# EAGLE schematic ww101board (EAGLE 7.6.0)

## Sheet 1 of 4: User Interface
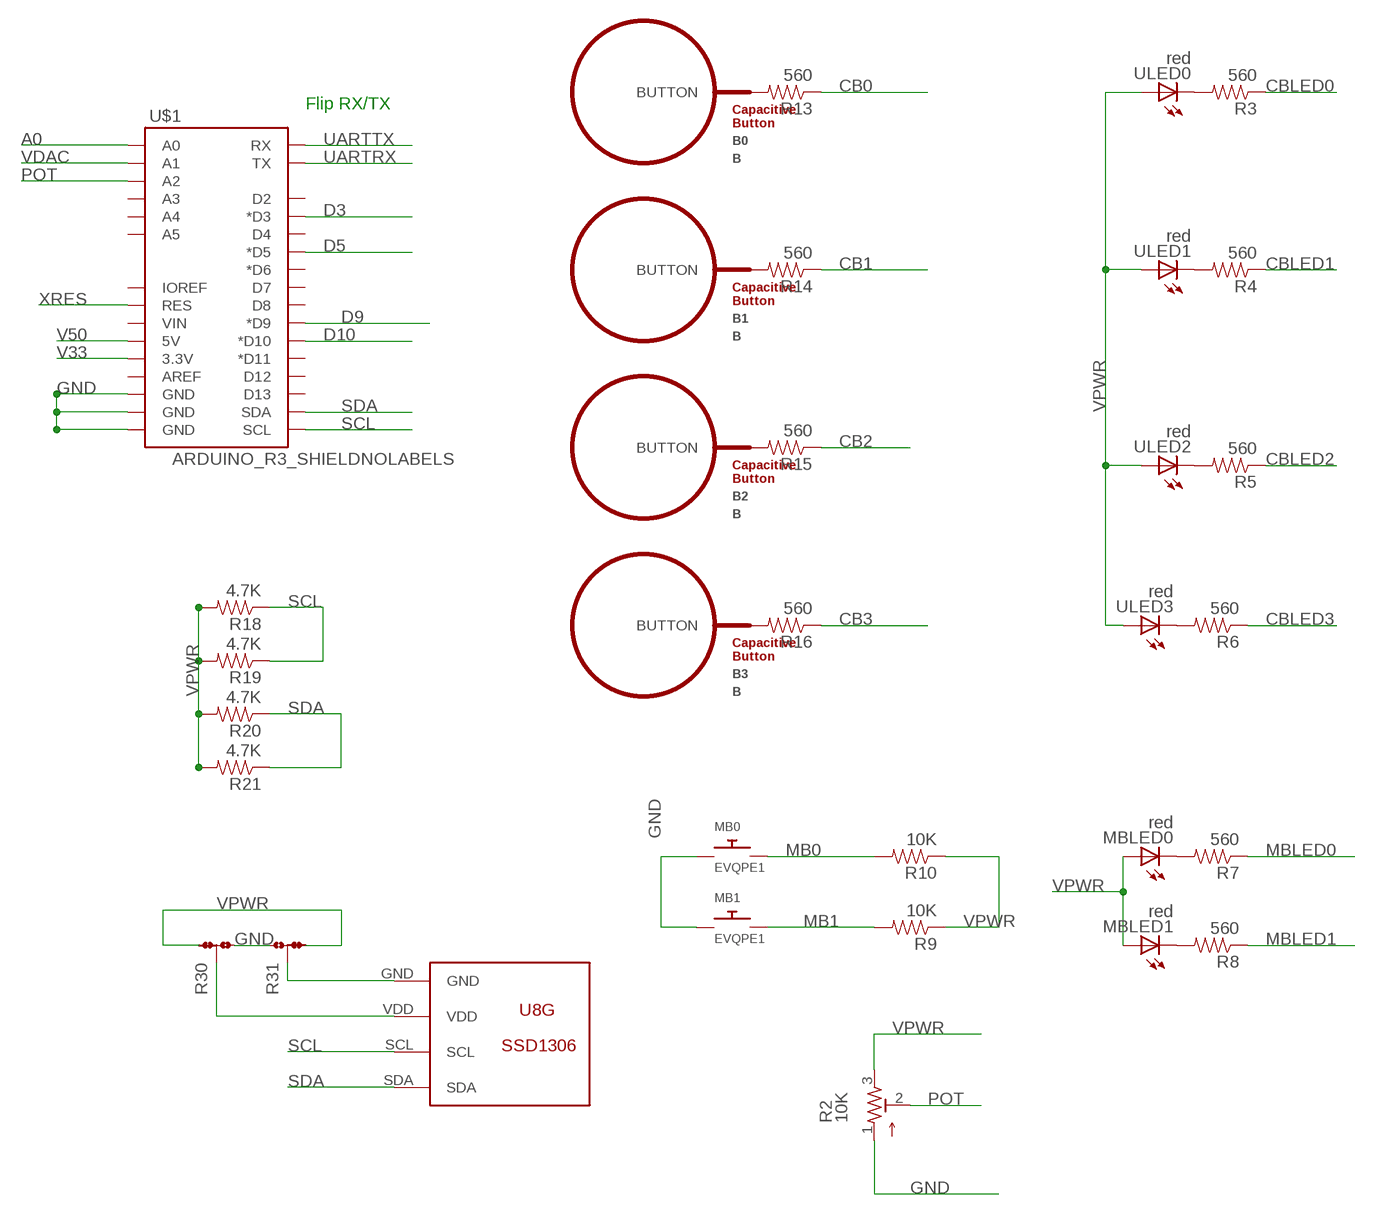
[diagram p0: schematic, sheet 1]

### Parts
B0  B  BUTTON_PASSIVE10MM  [BUTTON_PASSIVE_10MM]
B1  B  BUTTON_PASSIVE10MM  [BUTTON_PASSIVE_10MM]
B2  B  BUTTON_PASSIVE10MM  [BUTTON_PASSIVE_10MM]
B3  B  BUTTON_PASSIVE10MM  [BUTTON_PASSIVE_10MM]
MB0  EVQPE1  [SWITCH]
MB1  EVQPE1  [SWITCH]
MBLED0  red  LEDCHIP-LED0603  [CHIP-LED0603]
MBLED1  red  LEDCHIP-LED0603  [CHIP-LED0603]
R2  10K  TRIM_US-3386P  [3386P]
R3  560  RESISTOR0603  [0603-RES]
R4  560  RESISTOR0603  [0603-RES]
R5  560  RESISTOR0603  [0603-RES]
R6  560  RESISTOR0603  [0603-RES]
R7  560  RESISTOR0603  [0603-RES]
R8  560  RESISTOR0603  [0603-RES]
R9  10K  RESISTOR0603  [0603-RES]
R10  10K  RESISTOR0603  [0603-RES]
R13  560  RESISTOR0603  [0603-RES]
R14  560  RESISTOR0603  [0603-RES]
R15  560  RESISTOR0603  [0603-RES]
R16  560  RESISTOR0603  [0603-RES]
R18  4.7K  RESISTOR0603  [0603-RES]
R19  4.7K  RESISTOR0603  [0603-RES]
R20  4.7K  RESISTOR0603  [0603-RES]
R21  4.7K  RESISTOR0603  [0603-RES]
R30  JMP-3-1_2  [JMP-3-1_2]
R31  JMP-3-2_3  [JMP-3-2_3]
U$1  ARDUINO_R3_SHIELDNOLABELS  [UNO_R3_SHIELD_NOLABELS]
U$2  U8G-096-OLED  [096-SSD1306]
ULED0  red  LEDCHIP-LED0603  [CHIP-LED0603]
ULED1  red  LEDCHIP-LED0603  [CHIP-LED0603]
ULED2  red  LEDCHIP-LED0603  [CHIP-LED0603]
ULED3  red  LEDCHIP-LED0603  [CHIP-LED0603]

### Nets
A0: U$1.A0 ; also sheet 4
CB0: R13.1 ; also sheet 2
CB1: R14.1 ; also sheet 2
CB2: R15.1 ; also sheet 2
CB3: R16.1 ; also sheet 2
CBLED0: R3.1 ; also sheet 2
CBLED1: R4.1 ; also sheet 2
CBLED2: R5.1 ; also sheet 2
CBLED3: R6.1 ; also sheet 2
D3: U$1.D3(*D3) ; also sheet 2
D5: U$1.D5(*D5) ; also sheet 2
D9: U$1.D9(*D9) ; also sheet 2
D10: U$1.D10(*D10) ; also sheet 2
GND: MB0.P$1 MB1.P$1 R2.1 R30.3 R31.1 U$1.GND@0(GND) U$1.GND@1(GND) U$1.GND@2(GND) ; also sheet 2,4
MB0: MB0.P$2 R10.2 ; also sheet 2
MB1: MB1.P$2 R9.2 ; also sheet 2
MBLED0: R7.1 ; also sheet 2
MBLED1: R8.1 ; also sheet 2
N$2: B0.BUTTON R13.2
N$5: B1.BUTTON R14.2
N$7: B2.BUTTON R15.2
N$8: R3.2 ULED0.C
N$9: R4.2 ULED1.C
N$10: R5.2 ULED2.C
N$11: R6.2 ULED3.C
N$12: MBLED0.C R7.2
N$13: MBLED1.C R8.2
N$14: R30.2 U$2.VDD
N$15: B3.BUTTON R16.2
N$17: R31.2 U$2.GND
POT: R2.2 U$1.A2 ; also sheet 2
SCL: R18.1 R19.1 U$1.SCL U$2.SCL ; also sheet 2
SDA: R20.1 R21.1 U$1.SDA U$2.SDA ; also sheet 2
UARTRX: U$1.TX ; also sheet 2
UARTTX: U$1.RX ; also sheet 2
V33: U$1.3.3V ; also sheet 3
V50: U$1.5V ; also sheet 3
VDAC: U$1.A1 ; also sheet 2
VPWR: MBLED0.A MBLED1.A R2.3 R9.1 R10.1 R18.2 R19.2 R20.2 R21.2 R30.1 R31.3 ULED0.A ULED1.A ULED2.A ULED3.A ; also sheet 2,3,4
XRES: U$1.RES ; also sheet 2
Unconnected: U$1.A3 U$1.A4 U$1.A5 U$1.AREF U$1.D2 U$1.D4 U$1.D6(*D6) U$1.D7 U$1.D8 U$1.D11(*D11) U$1.D12 U$1.D13 U$1.IOREF U$1.VIN

### Notes on the sheet
- Flip RX/TX

## Sheet 2 of 4: PSoC
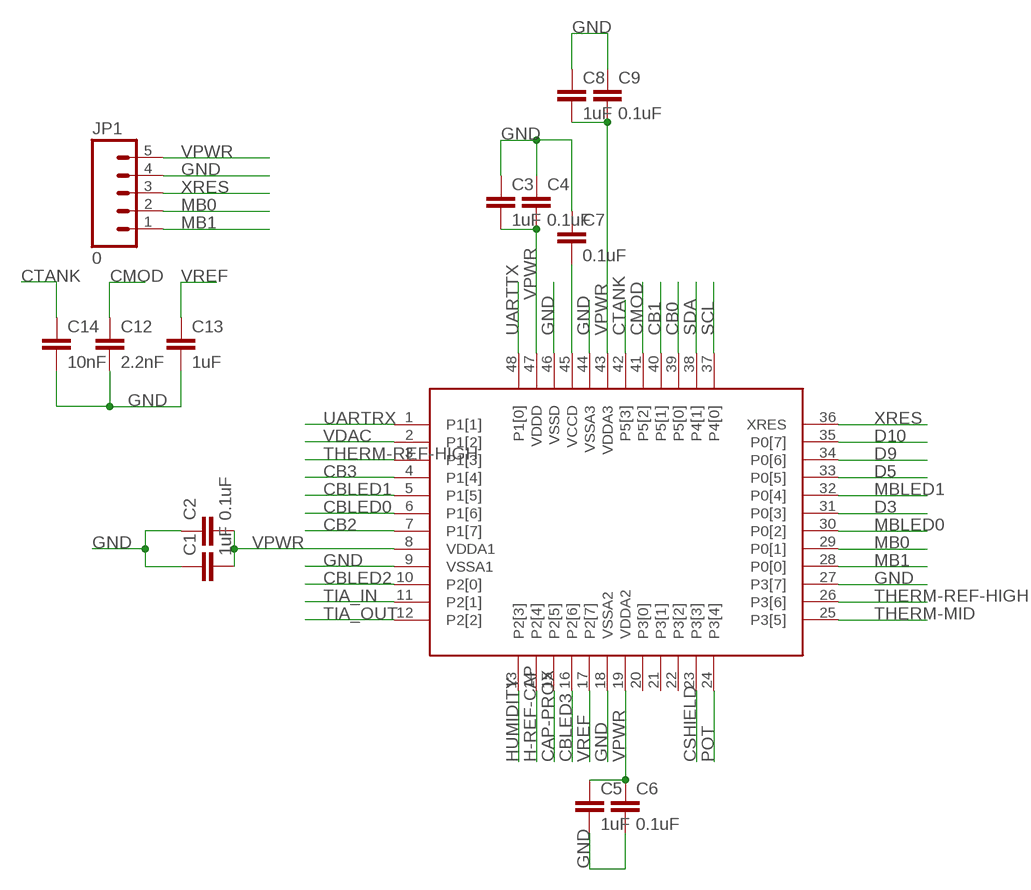
[diagram p1: schematic, sheet 2]

### Parts
C1  1uF  CAP0603-CAP  [0603-CAP]
C2  0.1uF  CAP0603-CAP  [0603-CAP]
C3  1uF  CAP0603-CAP  [0603-CAP]
C4  0.1uF  CAP0603-CAP  [0603-CAP]
C5  1uF  CAP0603-CAP  [0603-CAP]
C6  0.1uF  CAP0603-CAP  [0603-CAP]
C7  0.1uF  CAP0603-CAP  [0603-CAP]
C8  1uF  CAP0603-CAP  [0603-CAP]
C9  0.1uF  CAP0603-CAP  [0603-CAP]
C12  2.2nF  CAP0603-CAP  [0603-CAP]
C13  1uF  CAP0603-CAP  [0603-CAP]
C14  10nF  CAP0603-CAP  [0603-CAP]
JP1  0  M05LOCK  [1X05_LOCK]
U$7  CY8C4A45-48  [TQFP-7X7-48]

### Nets
CAP-PROX: U$7.15(P2[5])
CB0: U$7.39(P5[0]) ; also sheet 1
CB1: U$7.40(P5[1]) ; also sheet 1
CB2: U$7.7(P1[7]) ; also sheet 1
CB3: U$7.4(P1[4]) ; also sheet 1
CBLED0: U$7.6(P1[6]) ; also sheet 1
CBLED1: U$7.5(P1[5]) ; also sheet 1
CBLED2: U$7.10(P2[0]) ; also sheet 1
CBLED3: U$7.16(P2[6]) ; also sheet 1
CMOD: C12.1 U$7.41(P5[2])
CSHIELD: U$7.23(P3[3])
CTANK: C14.1 U$7.42(P5[3])
D3: U$7.31(P0[3]) ; also sheet 1
D5: U$7.33(P0[5]) ; also sheet 1
D9: U$7.34(P0[6]) ; also sheet 1
D10: U$7.35(P0[7]) ; also sheet 1
GND: C1.1 C2.1 C3.1 C4.1 C5.2 C6.2 C7.1 C8.1 C9.1 C12.2 C13.2 C14.2 JP1.4 U$7.9(VSSA1) U$7.18(VSSA2) U$7.27(P3[7]) U$7.44(VSSA3) U$7.46(VSSD) ; also sheet 1,4
H-REF-CAP: U$7.14(P2[4]) ; also sheet 4
HUMIDITY: U$7.13(P2[3]) ; also sheet 4
MB0: JP1.2 U$7.29(P0[1]) ; also sheet 1
MB1: JP1.1 U$7.28(P0[0]) ; also sheet 1
MBLED0: U$7.30(P0[2]) ; also sheet 1
MBLED1: U$7.32(P0[4]) ; also sheet 1
N$20: C7.2 U$7.45(VCCD)
POT: U$7.24(P3[4]) ; also sheet 1
SCL: U$7.37(P4[0]) ; also sheet 1
SDA: U$7.38(P4[1]) ; also sheet 1
THERM-MID: U$7.25(P3[5]) ; also sheet 4
THERM-REF-HIGH: U$7.3(P1[3]) U$7.26(P3[6]) ; also sheet 4
TIA_IN: U$7.11(P2[1]) ; also sheet 4
TIA_OUT: U$7.12(P2[2]) ; also sheet 4
UARTRX: U$7.1(P1[1]) ; also sheet 1
UARTTX: U$7.48(P1[0]) ; also sheet 1
VDAC: U$7.2(P1[2]) ; also sheet 1
VPWR: C1.2 C2.2 C3.2 C4.2 C5.1 C6.1 C8.2 C9.2 JP1.5 U$7.8(VDDA1) U$7.19(VDDA2) U$7.43(VDDA3) U$7.47(VDDD) ; also sheet 1,3,4
VREF: C13.1 U$7.17(P2[7])
XRES: JP1.3 U$7.36(XRES) ; also sheet 1
Unconnected: U$7.20(P3[0]) U$7.21(P3[1]) U$7.22(P3[2])

## Sheet 3 of 4: Power
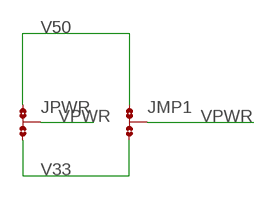
[diagram p2: schematic, sheet 3]

### Parts
JMP1  0  JMP-3-NO-PTH  [JMP-3-NO-PTH-2.54]
JPWR  0  JMP-3-NO-0603  [JMP-3-NO-0603]

### Nets
V33: JMP1.3 JPWR.3 ; also sheet 1
V50: JMP1.1 JPWR.1 ; also sheet 1
VPWR: JMP1.2 JPWR.2 ; also sheet 1,2,4

## Sheet 4 of 4: Sensor
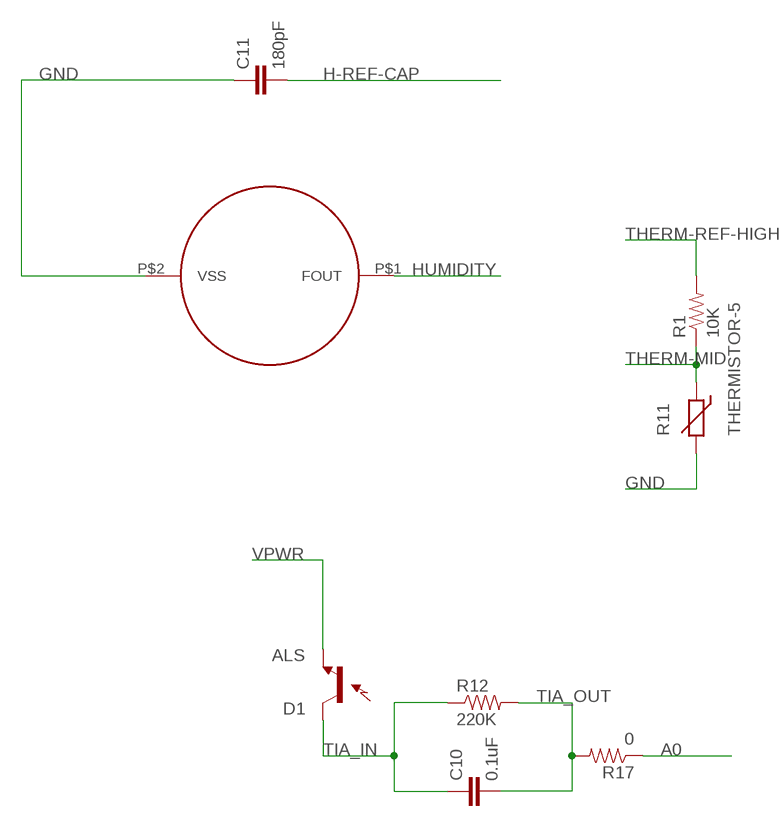
[diagram p3: schematic, sheet 4]

### Parts
C10  0.1uF  CAP0603-CAP  [0603-CAP]
C11  180pF  CAP0603-CAP  [0603-CAP]
D1  ALS  [ALS]
HUMIDITY  HPP801A031  [HUMIDITY]
R1  10K  RESISTOR0603  [0603-RES]
R11  THERMISTOR-5  [R-5]
R12  220K  RESISTOR0603  [0603-RES]
R17  0  RESISTOR0603  [0603-RES]

### Nets
A0: R17.1 ; also sheet 1
GND: C11.1 HUMIDITY.P$2(VSS) R11.2 ; also sheet 1,2
H-REF-CAP: C11.2 ; also sheet 2
HUMIDITY: HUMIDITY.P$1(FOUT) ; also sheet 2
THERM-MID: R1.1 R11.1 ; also sheet 2
THERM-REF-HIGH: R1.2 ; also sheet 2
TIA_IN: C10.1 D1.CATHODE(C1) R12.1 ; also sheet 2
TIA_OUT: C10.2 R12.2 R17.2 ; also sheet 2
VPWR: D1.ANNODE(E1) ; also sheet 1,2,3

## Library data of the parts
B0 B1-B3 = PatternAgents-TouchWidgets:BUTTON_PASSIVE: Button, Passive Capacitive/Touch Sensing Type Source : http://www.PatternAgents.com Github : https://github.com/PatternAgents License : http://creativecommons.org/licenses/by-sa/3.1/ (Creative Commons 3.1) THIS SOFTWARE IS PROVIDED BY THE CONTRIBUTORS "AS IS" AND WITHOUT ANY EXPRESS OR IMPLIED WARRANTIES, INCLUDING, BUT NOT LIMITED TO, THE IMPLIED WARRANTIES OF MERCHANTABILITY AND FITNESS FOR A PARTICULAR PURPOSE ARE DISCLAIMED. IN NO EVENT SHALL THE COPYRIGHT OWNER OR CONTRIBUTORS BE LIABLE FOR ANY DIRECT, INDIRECT, INCIDENTAL, SPECIAL, EXEMPLARY, OR CONSEQUENTIAL DAMAGES (INCLUDING, BUT NOT LIMITED TO, PROCUREMENT OF SUBSTITUTE GOODS OR SERVICES; LOSS OF USE, DATA, OR PROFITS; OR BUSINESS INTERRUPTION) HOWEVER CAUSED AND ON ANY THEORY OF LIABILITY, WHETHER IN CONTRACT, STRICT LIABILITY, OR TORT (INCLUDING NEGLIGENCE OR OTHERWISE) ARISING IN ANY WAY OUT OF THE USE OF THIS SOFTWARE, EVEN IF ADVISED OF THE POSSIBILITY OF SUCH DAMAGE.
C1-C14 = PatternAgents-ProtoPads:CAP: Capacitor Standard 0603 ceramic capacitor, and 0.1" leaded capacitor.
D1 = IOTExpert:ALS: Ambient Light Sensor Vishay TEMD6200FX01 http://www.vishay.com/docs/81812/temd6200.pdf
HUMIDITY = IOTExpert:HPP801A031
JMP1 = PatternAgents-ProtoPads:JMP-3-NO: Three Terminal Jumper - Normally Open All Pads Open (unconnected) PatternAgents ProtoPads Library Schematic and PCB layout libraries for design patterns by PatternAgents. For the CADSoft Eagle CAD program : http://www.cadsoftusa.com/download-eagle/ Source LBR : http://www.patternagents.com Github : https://github.com/PatternAgents License : http://creativecommons.org/licenses/by-sa/4.0/ (Creative Commons 4.0) THIS SOFTWARE IS PROVIDED BY THE CONTRIBUTORS "AS IS" AND WITHOUT ANY EXPRESS OR IMPLIED WARRANTIES, INCLUDING, BUT NOT LIMITED TO, THE IMPLIED WARRANTIES OF MERCHANTABILITY AND FITNESS FOR A PARTICULAR PURPOSE ARE DISCLAIMED. IN NO EVENT SHALL THE COPYRIGHT OWNER OR CONTRIBUTORS BE LIABLE FOR ANY DIRECT, INDIRECT, INCIDENTAL, SPECIAL, EXEMPLARY, OR CONSEQUENTIAL DAMAGES (INCLUDING, BUT NOT LIMITED TO, PROCUREMENT OF SUBSTITUTE GOODS OR SERVICES; LOSS OF USE, DATA, OR PROFITS; OR BUSINESS INTERRUPTION) HOWEVER CAUSED AND ON ANY THEORY OF LIABILITY, WHETHER IN CONTRACT, STRICT LIABILITY, OR TORT (INCLUDING NEGLIGENCE OR OTHERWISE) ARISING IN ANY WAY OUT OF THE USE OF THIS SOFTWARE, EVEN IF ADVISED OF THE POSSIBILITY OF SUCH DAMAGE.
JP1 = SparkFun-Connectors:M05: Header 5 Standard 5-pin 0.1" header. Use with straight break away headers (SKU : PRT-00116), right angle break away headers (PRT-00553), swiss pins (PRT-00743), machine pins (PRT-00117), and female headers (PRT-00115). Molex polarized connector foot print use with SKU : PRT-08230 with associated crimp pins and housings.
JPWR = PatternAgents-ProtoPads:JMP-3-NO: Three Terminal Jumper - Normally Open All Pads Open (unconnected) PatternAgents ProtoPads Library Schematic and PCB layout libraries for design patterns by PatternAgents. For the CADSoft Eagle CAD program : http://www.cadsoftusa.com/download-eagle/ Source LBR : http://www.patternagents.com Github : https://github.com/PatternAgents License : http://creativecommons.org/licenses/by-sa/4.0/ (Creative Commons 4.0) THIS SOFTWARE IS PROVIDED BY THE CONTRIBUTORS "AS IS" AND WITHOUT ANY EXPRESS OR IMPLIED WARRANTIES, INCLUDING, BUT NOT LIMITED TO, THE IMPLIED WARRANTIES OF MERCHANTABILITY AND FITNESS FOR A PARTICULAR PURPOSE ARE DISCLAIMED. IN NO EVENT SHALL THE COPYRIGHT OWNER OR CONTRIBUTORS BE LIABLE FOR ANY DIRECT, INDIRECT, INCIDENTAL, SPECIAL, EXEMPLARY, OR CONSEQUENTIAL DAMAGES (INCLUDING, BUT NOT LIMITED TO, PROCUREMENT OF SUBSTITUTE GOODS OR SERVICES; LOSS OF USE, DATA, OR PROFITS; OR BUSINESS INTERRUPTION) HOWEVER CAUSED AND ON ANY THEORY OF LIABILITY, WHETHER IN CONTRACT, STRICT LIABILITY, OR TORT (INCLUDING NEGLIGENCE OR OTHERWISE) ARISING IN ANY WAY OUT OF THE USE OF THIS SOFTWARE, EVEN IF ADVISED OF THE POSSIBILITY OF SUCH DAMAGE.; BOM: EXCLUDE
MB0 MB1 = IOTExpert:EVQPE1
MBLED0 MBLED1 ULED0 ULED1-ULED3 = adafruit:LED: LED OSRAM: - CHIPLED LG R971, LG N971, LY N971, LG Q971, LY Q971, LO R971, LY R971 LH N974, LH R974 LS Q976, LO Q976, LY Q976 LO Q996 - Hyper CHIPLED LW Q18S LB Q993, LB Q99A, LB R99A - SideLED LS A670, LO A670, LY A670, LG A670, LP A670 LB A673, LV A673, LT A673, LW A673 LH A674 LY A675 LS A676, LA A676, LO A676, LY A676, LW A676 LS A679, LY A679, LG A679 - Hyper Micro SIDELED® LS Y876, LA Y876, LO Y876, LY Y876 LT Y87S - SmartLED LW L88C, LW L88S LB L89C, LB L89S, LG L890 LS L89K, LO L89K, LY L89K LS L896, LA L896, LO L896, LY L896 - TOPLED LS T670, LO T670, LY T670, LG T670, LP T670 LSG T670, LSP T670, LSY T670, LOP T670, LYG T670 LG T671, LOG T671, LSG T671 LB T673, LV T673, LT T673, LW T673 LH T674 LS T676, LA T676, LO T676, LY T676, LB T676, LH T676, LSB T676, LW T676 LB T67C, LV T67C, LT T67C, LS T67K, LO T67K, LY T67K, LW E67C LS E67B, LA E67B, LO E67B, LY E67B, LB E67C, LV E67C, LT E67C LW T67C LS T679, LY T679, LG T679 LS T770, LO T770, LY T770, LG T770, LP T770 LB T773, LV T773, LT T773, LW T773 LH T774 LS E675, LA E675, LY E675, LS T675 LS T776, LA T776, LO T776, LY T776, LB T776 LHGB T686 LT T68C, LB T68C - Hyper Mini TOPLED® LB M676 - Mini TOPLED Santana® LG M470 LS M47K, LO M47K, LY M47K Source: http://www.osram.convergy.de/
R1 R3-R10 R12-R21 = PatternAgents-ProtoPads:RESISTOR: Resistor Basic schematic elements and footprints for 0603, 1206, and PTH resistors.
R2 = pot:TRIM_US-: POTENTIOMETER
R11 = varistor:THERMISTOR: THERMISTOR
R30 = PatternAgents-ProtoPads:JMP-3-1_2: Three Terminal Jumper - 1 & 2 Connected Positions 1and 2 are normally connected. PatternAgents ProtoPads Library Schematic and PCB layout libraries for design patterns by PatternAgents. For the CADSoft Eagle CAD program : http://www.cadsoftusa.com/download-eagle/ Source LBR : http://www.patternagents.com Github : https://github.com/PatternAgents License : http://creativecommons.org/licenses/by-sa/4.0/ (Creative Commons 4.0) THIS SOFTWARE IS PROVIDED BY THE CONTRIBUTORS "AS IS" AND WITHOUT ANY EXPRESS OR IMPLIED WARRANTIES, INCLUDING, BUT NOT LIMITED TO, THE IMPLIED WARRANTIES OF MERCHANTABILITY AND FITNESS FOR A PARTICULAR PURPOSE ARE DISCLAIMED. IN NO EVENT SHALL THE COPYRIGHT OWNER OR CONTRIBUTORS BE LIABLE FOR ANY DIRECT, INDIRECT, INCIDENTAL, SPECIAL, EXEMPLARY, OR CONSEQUENTIAL DAMAGES (INCLUDING, BUT NOT LIMITED TO, PROCUREMENT OF SUBSTITUTE GOODS OR SERVICES; LOSS OF USE, DATA, OR PROFITS; OR BUSINESS INTERRUPTION) HOWEVER CAUSED AND ON ANY THEORY OF LIABILITY, WHETHER IN CONTRACT, STRICT LIABILITY, OR TORT (INCLUDING NEGLIGENCE OR OTHERWISE) ARISING IN ANY WAY OUT OF THE USE OF THIS SOFTWARE, EVEN IF ADVISED OF THE POSSIBILITY OF SUCH DAMAGE.; BOM: EXCLUDE
R31 = PatternAgents-ProtoPads:JMP-3-2_3: Three Terminal Jumper - 2 & 3 Connected Positions 2 and 3 are normally connected. PatternAgents ProtoPads Library Schematic and PCB layout libraries for design patterns by PatternAgents. For the CADSoft Eagle CAD program : http://www.cadsoftusa.com/download-eagle/ Source LBR : http://www.patternagents.com Github : https://github.com/PatternAgents License : http://creativecommons.org/licenses/by-sa/4.0/ (Creative Commons 4.0) THIS SOFTWARE IS PROVIDED BY THE CONTRIBUTORS "AS IS" AND WITHOUT ANY EXPRESS OR IMPLIED WARRANTIES, INCLUDING, BUT NOT LIMITED TO, THE IMPLIED WARRANTIES OF MERCHANTABILITY AND FITNESS FOR A PARTICULAR PURPOSE ARE DISCLAIMED. IN NO EVENT SHALL THE COPYRIGHT OWNER OR CONTRIBUTORS BE LIABLE FOR ANY DIRECT, INDIRECT, INCIDENTAL, SPECIAL, EXEMPLARY, OR CONSEQUENTIAL DAMAGES (INCLUDING, BUT NOT LIMITED TO, PROCUREMENT OF SUBSTITUTE GOODS OR SERVICES; LOSS OF USE, DATA, OR PROFITS; OR BUSINESS INTERRUPTION) HOWEVER CAUSED AND ON ANY THEORY OF LIABILITY, WHETHER IN CONTRACT, STRICT LIABILITY, OR TORT (INCLUDING NEGLIGENCE OR OTHERWISE) ARISING IN ANY WAY OUT OF THE USE OF THIS SOFTWARE, EVEN IF ADVISED OF THE POSSIBILITY OF SUCH DAMAGE.; BOM: EXCLUDE
U$1 = SparkFun-Boards:ARDUINO_R3_SHIELD: Shield form compatible with the Arduino Uno R3.
U$2 = IOTExpert:U8G-096-OLED
U$7 = PatternAgents-Cypress:CY8C4A45-48